# EasyEDA Pro project ProPrj_Retro-boy-color_2026-08-08.epro, schematic Schematic_V2
Create Date: 2024-07-19; Page Name: P1; Project Name: Retro-boy-color; Schematic Name: Schematic_V2; Update Date: 2026-08-08; Company: 嘉立创EDA; Page Size: A4; Version: V1.0
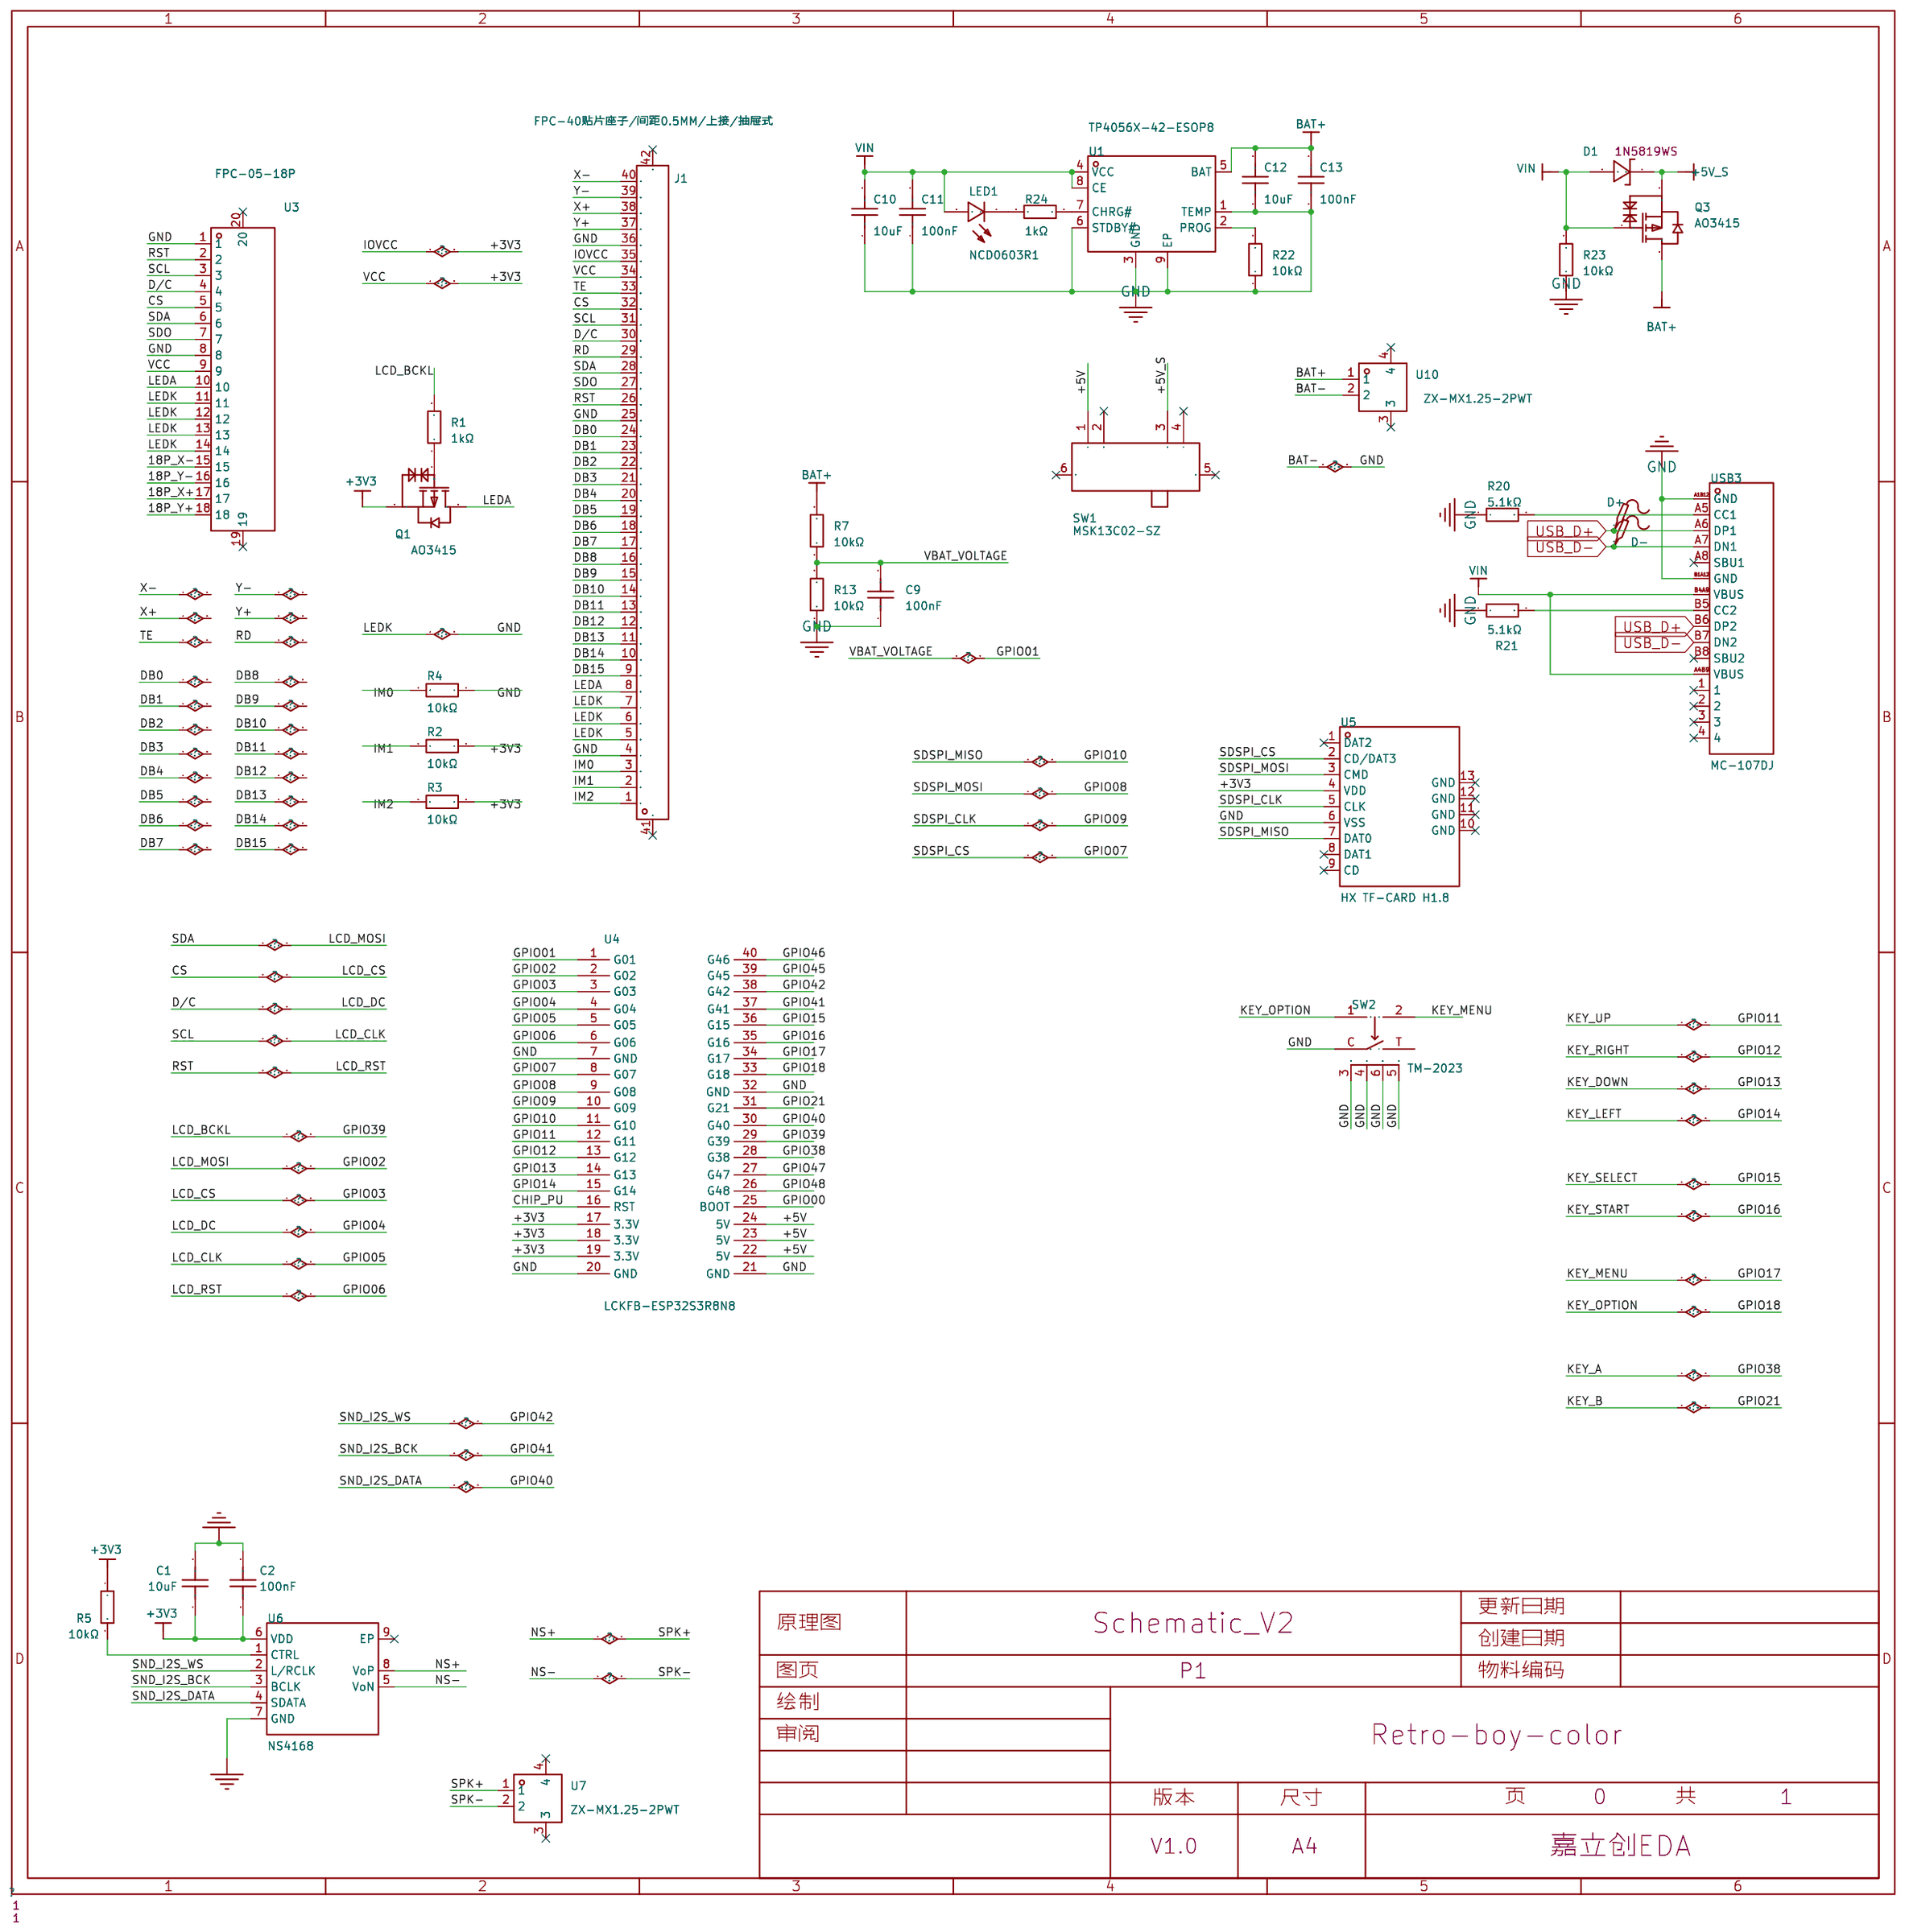
[diagram p0: schematic sheet]

## Parts
C1  10uF  [C0603]
C2  100nF  [C0603]
C9  100nF  [C0603]
C10  10uF  [C0603]
C11  100nF  [C0603]
C12  10uF  [C0603]
C13  100nF  [C0603]
D1  1N5819WS  [SOD-323_L1.8-W1.3-LS2.5-RD]
D+  -  [Test-Point-0.5mm]
D-  -  [Test-Point-0.5mm]
J1  FPC-40贴片座子/间距0.5MM/上接/抽屉式  [FPC-SMD_40P-P0.50_FPC-40-2]
LED1  NCD0603R1  [LED0603-RD_RED]
Q1  AO3415  [SOT-23-3_L2.9-W1.4-P1.90-LS2.5-BR]
Q3  AO3415  [SOT-23-3_L2.9-W1.4-P1.90-LS2.5-BR]
R1  1kΩ  [R0603]
R2  10kΩ  [R0603]
R3  10kΩ  [R0603]
R4  10kΩ  [R0603]
R5  10kΩ  [R0603]
R7  10kΩ  [R0603]
R13  10kΩ  [R0603]
R20  5.1kΩ  [R0603]
R21  5.1kΩ  [R0603]
R22  10kΩ  [R0603]
R23  10kΩ  [R0603]
R24  1kΩ  [R0603]
SW1  MSK13C02-SZ  [SW-SMD_MSK13C02-SZ]
SW2  TM-2023  [SW-SMD_TM-2023-1]
U1  TP4056X-42-ESOP8  [SOP-8_L4.9-W3.9-P1.27-LS6.0-TL-EP]
U3  FPC-05-18P  [FPC-SMD_18P-P0.50_XW05200-18]
U4  LCKFB-ESP32S3R8N8  [DIP-40_L20.32-W51.66-P2.54-LS15.24]
U5  HX TF-CARD H1.8  [TF-SMD_HX-TF-CARD-H1.8]
U6  NS4168  [ESOP-8_L4.9-W3.9-P1.27-LS6.0-BL-EP-1]
U7  ZX-MX1.25-2PWT  [CONN-SMD_2P-P1.25_MEGASTAR_ZX-MX1.25-2PWT]
U10  ZX-MX1.25-2PWT  [CONN-SMD_2P-P1.25_MEGASTAR_ZX-MX1.25-2PWT]
USB3  MC-107DJ  [TYPE-C-SMD_MC-107DJ]

## Library data of the parts
C1 C10 C12 = CL10A106MA8NRNC: 容值:10uF;精度:±20%;额定电压:25V;材质(温度系数):X5R;; LCSC Part Name: 10uF ±20% 25V; Supplier Part: C96446; Manufacturer: SAMSUNG(三星); Supplier Footprint: 0603; JLCPCB Part Class: 基础库; Datasheet: https://atta.szlcsc.com/upload/public/pdf/source/20160218/1457707763339.pdf; Supplier: LCSC; Tolerance: ±20%; Voltage Rated: 25V; Temperature Coefficient: X5R
C2 C9 C11 C13 = CC0603KRX7R9BB104: 容值:100nF;精度:±10%;额定电压:50V;材质(温度系数):X7R;; LCSC Part Name: 100nF ±10% 50V; Supplier Part: C14663; Manufacturer: YAGEO(国巨); Supplier Footprint: 0603; Datasheet: https://atta.szlcsc.com/upload/public/pdf/source/20180910/C282072_33301C7F631E79921B82A8DAC6BCC5B3.pdf; Supplier: LCSC; Tolerance: ±10%; Voltage Rated: 50V; Temperature Coefficient: X7R
D1 = 1N5819WS_C191023: 直流反向耐压(Vr):40V;平均整流电流(Io):1A;正向压降(Vf):600mV@1A;; LCSC Part Name: 40V1A600mV@1A; Supplier Part: C191023; Manufacturer: Hottech(合科泰); Supplier Footprint: SOD-323; JLCPCB Part Class: BasicPart; Datasheet: https://atta.szlcsc.com/upload/public/pdf/source/20220428/3CB86FD8D28D653594B4E35F9D5AEFD9.pdf; Supplier: LCSC; Reverse Voltage (Vr): 40V; Average Rectified Current (Io): 1A; Forward Voltage (Vf@If): 600mV@1A
D+ D- = Test-Point: Test Point 测试点
J1 = FPC-40贴片座子/间距0.5MM/上接/抽屉式: Supplier Part: C9900017908; Supplier Footprint: FPC-SMD-40P; JLCPCB Part Class: 扩展库; Supplier: LCSC
LED1 = NCD0603R1_C84263: 发光颜色:红灯;; LCSC Part Name: 红灯; Supplier Part: C84263; Manufacturer: 国星光电; Supplier Footprint: 0603; JLCPCB Part Class: 扩展库; Datasheet: https://atta.szlcsc.com/upload/public/pdf/source/20200820/C84263_DABC6A75E58F576973B407FDBA283D60.pdf; Supplier: LCSC; Emitted Color: 红灯
Q1 Q3 = AO3415: Supplier Part: C9900017638; Supplier Footprint: SOT-23; JLCPCB Part Class: 扩展库; Supplier: LCSC
R1 = 0603WAF1001T5E: 电阻类型:厚膜电阻;阻值:1kΩ;精度:±1%;功率:100mW;最大工作电压:75V;温度系数:±100ppm/℃;; LCSC Part Name: 1kΩ ±1% 100mW 厚膜电阻; Supplier Part: C21190; Manufacturer: UNI-ROYAL(厚声); Supplier Footprint: 0603; JLCPCB Part Class: 基础库; Datasheet: https://atta.szlcsc.com/upload/public/pdf/source/20200306/C422600_1E6D84923E4A46A82E41ADD87F860B5C.pdf; Supplier: LCSC; Type: 厚膜电阻; Tolerance: ±1%; Power(Watts): 100mW; Overload Voltage (Max): 75V; Temperature Coefficient: ±100ppm/℃; Operating Temperature Range: -55℃~+155℃
R2-R5 = 0603WAF1002T5E: 电阻类型:厚膜电阻;阻值:10kΩ;精度:±1%;功率:100mW;最大工作电压:75V;温度系数:±100ppm/℃;; LCSC Part Name: 厚膜电阻 10kΩ ±1% 100mW; Supplier Part: C25804; Manufacturer: UNI-ROYAL(厚声); Supplier Footprint: 0603; JLCPCB Part Class: 基础库; Datasheet: https://atta.szlcsc.com/upload/public/pdf/source/20200306/C422600_1E6D84923E4A46A82E41ADD87F860B5C.pdf; Supplier: LCSC; Type: 厚膜电阻; Tolerance: ±1%; Power(Watts): 100mW; Overload Voltage (Max): 75V; Temperature Coefficient: ±100ppm/℃; Operating Temperature Range: -55℃~+155℃
R7 R13 R22 R23 = 0603WAF1002T5E: 电阻类型:厚膜电阻;阻值:10kΩ;精度:±1%;功率:100mW;; LCSC Part Name: 厚膜电阻 10kΩ ±1% 100mW; Supplier Part: C25804; Manufacturer: UNI-ROYAL(厚声); Supplier Footprint: 0603; JLCPCB Part Class: 基础库; Datasheet: https://atta.szlcsc.com/upload/public/pdf/source/20200306/C422600_1E6D84923E4A46A82E41ADD87F860B5C.pdf; Supplier: LCSC; Type: 厚膜电阻; Tolerance: ±1%; Power(Watts): 100mW; Overload Voltage (Max): 75V; Temperature Coefficient: ±100ppm/℃; Operating Temperature Range: -55℃~+155℃
R20 R21 = 0603WAF5101T5E: 电阻类型:厚膜电阻;阻值:5.1kΩ;精度:±1%;功率:100mW;最大工作电压:75V;温度系数:±100ppm/℃;; LCSC Part Name: 5.1kΩ ±1% 100mW 厚膜电阻; Supplier Part: C23186; Manufacturer: UNI-ROYAL(厚声); Supplier Footprint: 0603; Datasheet: https://atta.szlcsc.com/upload/public/pdf/source/20200306/C422600_1E6D84923E4A46A82E41ADD87F860B5C.pdf; Supplier: LCSC; Type: 厚膜电阻; Tolerance: ±1%; Power(Watts): 100mW; Overload Voltage (Max): 75V; Temperature Coefficient: ±100ppm/℃; Operating Temperature Range: -55℃~+155℃
R24 = 0603WAF1001T5E: 电阻类型:厚膜电阻;阻值:1kΩ;精度:±1%;功率:100mW;; LCSC Part Name: 1kΩ ±1% 100mW 厚膜电阻; Supplier Part: C21190; Manufacturer: UNI-ROYAL(厚声); Supplier Footprint: 0603; JLCPCB Part Class: 基础库; Datasheet: https://atta.szlcsc.com/upload/public/pdf/source/20200306/C422600_1E6D84923E4A46A82E41ADD87F860B5C.pdf; Supplier: LCSC; Type: 厚膜电阻; Tolerance: ±1%; Power(Watts): 100mW; Overload Voltage (Max): 75V; Temperature Coefficient: ±100ppm/℃; Operating Temperature Range: -55℃~+155℃
SW1 = MSK13C02-SZ: 电路结构:单刀三掷;安装方式:卧贴;开关颜色:-;额定电流(DC):100mA;额定电压(DC):12V;额定电流(AC):-;额定电压(AC):-;机械寿命:1万次;; LCSC Part Name: 贴片拨动/三档侧拨 8脚拨动 黑柄，柄长1.5mm,耐温袋装，高品质; Supplier Part: C2681569; Manufacturer: SHOU HAN(首韩); Supplier Footprint: SMD; JLCPCB Part Class: 扩展库; Datasheet: https://atta.szlcsc.com/upload/public/pdf/source/20231031/C8BED455619FEEF308EBA39F2FB3EDEE.pdf; Supplier: LCSC; Circuit: 单刀三掷; Pin Style: SMD接片; Switch Length: 9.9mm; Switch Width: 2.7mm; Switch Height: 1.5mm; Mounting Style: 卧贴; Current Rating (DC): 100mA; Voltage Rating (DC): 12V; Mechanical Life: 1万次; Operating Temperature: -25℃~+70℃
SW2 = TM-2023: 3挡拨轮开关  音响周边开关 多功能开关上中下按键; LCSC Part Name: 3挡拨轮开关; Supplier Part: C318951; Manufacturer: XKB Connectivity(中国星坤); Supplier Footprint: SMD-8P,9.5x9.5mm; JLCPCB Part Class: 扩展库; Datasheet: https://atta.szlcsc.com/upload/public/pdf/source/20211015/4E21B3A9DEF1E687333BA1DF36F89D09.pdf; Supplier: LCSC
U1 = TP4056X-42-ESOP8: Supplier Part: C2763448; Manufacturer: TOPPOWER(南京拓微); Supplier Footprint: SOP-8-EP-150mil; JLCPCB Part Class: 扩展库; Datasheet: https://atta.szlcsc.com/upload/public/pdf/source/20221111/3D7D53D5011BF4ED4C4D0D9BFDBB1404.pdf; Supplier: LCSC
U3 = FPC-05-18P: Supplier Part: C9900014287; JLCPCB Part Class: 扩展库; Supplier: LCSC
U4 = LCKFB-ESP32S3R8N8: LCSC Part Name: 立创·ESP32S3R8N8 开发板; Supplier Part: C20626143; Manufacturer: 立创开发板; Datasheet: https://atta.szlcsc.com/upload/public/pdf/source/20240305/5BD17ECD91284FC4EAAB3B5676669C6C.pdf; Supplier: LCSC
U5 = HX TF-CARD H1.8: 卡连接方式:自弹式;卡类型:MicroSD卡(TF卡);连接器类型:卡座;本体最大高度:1.8mm;触头材质:铜合金;触头镀层:金;工作温度范围:-40℃~+70℃;; LCSC Part Name: 自弹式 MicroSD卡(TF卡) 卡座; Supplier Part: C19189036; Manufacturer: hanxia(韩下); Supplier Footprint: SMD; Datasheet: https://atta.szlcsc.com/upload/public/pdf/source/20231103/42D1E7AC2772CC1CF5ED366AE800D376.pdf; Supplier: LCSC; Card Connection Mode: 自弹式; Card Type: MicroSD卡(TF卡); Connector Type: 卡座; Maximum Body Height: 1.8mm; Contact Material: 铜合金; Contact Plating: 金; Operating Temperature Range: -40℃~+70℃
U6 = NS4168: Supplier Part: C9900042517; Supplier Footprint: ESOP-8; Supplier: LCSC
U7 U10 = ZX-MX1.25-2PWT: 插针结构:1x2P;间距:1.25mm;安装方式:卧贴;参考系列:-;总PIN数:2P;排数:1;每排PIN数:2;行距:-;额定电流:1A;触头材质:黄铜;触头镀层:锡;工作温度范围:-25℃~+85℃;; LCSC Part Name: 1x2P 间距:1.25mm 卧贴; Supplier Part: C7430468; Manufacturer: Megastar(兆星); Supplier Footprint: SMD,P=1.25mm,卧贴; JLCPCB Part Class: 扩展库; Datasheet: https://atta.szlcsc.com/upload/public/pdf/source/20230619/2BD294665F872DB10EDB44FDEDF5F6D3.pdf; Supplier: LCSC; Pins Structure: 1x2P; Pitch: 1.25mm; Mounting Style: 卧贴; Number of Pins: 2P; Number of Rows: 1; Number of PINs Per Row: 2; Current Rating (Max): 1A; Contact Material: 黄铜; Contact Plating: 锡; Operating Temperature Range: -25℃~+85℃
USB3 = MC-107DJ: 连接器类型:Type-C;标准:USB 3.1;公母:母;端口数量:1;触点数量:16P;安装方式:卧贴;额定电流 - 电源:5A;触头材质:-;触头镀层:-;工作温度范围:-30℃~+85℃;焊接温度(最大值):-;; LCSC Part Name: Type-C 母 卧贴; Supplier Part: C3039323; Manufacturer: HANBO(汉博); Supplier Footprint: SMD; JLCPCB Part Class: 扩展库; Datasheet: https://atta.szlcsc.com/upload/public/pdf/source/20221111/FC1EB886C14056FAD47B50E8694458AD.pdf; Supplier: LCSC; Connector Type: Type-C; Standard: USB 3.1; Gender: 母; Number of Ports: 1; Number of Contacts: 16P; Mounting Style: 卧贴; Current Rating - Power (Max): 5A; Operating Temperature Range: -30℃~+85℃

## Nets
+3V3: C1.1 C2.1 J1.34 J1.35 Q1.2(S) R2.1 R3.1 R5.1 U3.9 U4.17(3.3V) U4.18(3.3V) U4.19(3.3V) U5.4(VDD) U6.6(VDD)
+5V: SW1.1 U4.22(5V) U4.23(5V) U4.24(5V)
+5V_S: D1.1(C) Q3.2(S) SW1.3
GND: C1.2 C2.2 C9.1 C10.1 C11.1 C12.1 C13.1 J1.4 J1.5 J1.6 J1.7 J1.25 J1.36 R4.1 R13.1 R20.1 R21.1 R22.1 R23.1 SW2.3 SW2.4 SW2.5 SW2.6 SW2.C U1.1(TEMP) U1.3(GND) U1.6(STDBY#) U1.9(EP) U3.1 U3.8 U3.11 U3.12 U3.13 U3.14 U4.7(GND) U4.20(GND) U4.21(GND) U4.32(GND) U5.6(VSS) U6.7(GND) U10.2 USB3.A1B12(GND) USB3.B1A12(GND)
VIN: C10.2 C11.2 D1.2(A) LED1.2(A) Q3.1(G) R23.2 U1.4(VCC) U1.8(CE) USB3.A4B9(VBUS) USB3.B4A9(VBUS)
18P_X+: U3.17
18P_X-: U3.15
18P_Y+: U3.18
18P_Y-: U3.16
BAT+: C12.2 C13.2 Q3.3(D) R7.2 U1.5(BAT) U10.1
CHIP_PU: U4.16(RST)
CS: J1.32 U3.5 U4.3(G03)
D/C: J1.30 U3.4 U4.4(G04)
DB0: J1.24
DB1: J1.23
DB2: J1.22
DB3: J1.21
DB4: J1.20
DB5: J1.19
DB6: J1.18
DB7: J1.17
DB8: J1.16
DB9: J1.15
DB10: J1.14
DB11: J1.13
DB12: J1.12
DB13: J1.11
DB14: J1.10
DB15: J1.9
GPIO00: U4.25(BOOT)
GPIO01: C9.2 R7.1 R13.2 U4.1(G01)
GPIO02: J1.28 U3.6 U4.2(G02)
GPIO05: J1.31 U3.3 U4.5(G05)
GPIO06: J1.26 U3.2 U4.6(G06)
GPIO07: U4.8(G07) U5.2(CD/DAT3)
GPIO08: U4.9(G08) U5.3(CMD)
GPIO09: U4.10(G09) U5.5(CLK)
GPIO10: U4.11(G10) U5.7(DAT0)
GPIO11: U4.12(G11)
GPIO12: U4.13(G12)
GPIO13: U4.14(G13)
GPIO14: U4.15(G14)
GPIO15: U4.36(G15)
GPIO16: U4.35(G16)
GPIO17: SW2.2 U4.34(G17)
GPIO18: SW2.1 U4.33(G18)
GPIO21: U4.31(G21)
GPIO38: U4.28(G38)
GPIO39: R1.2 U4.29(G39)
GPIO40: U4.30(G40) U6.4(SDATA)
GPIO41: U4.37(G41) U6.3(BCLK)
GPIO42: U4.38(G42) U6.2(L/RCLK)
GPIO45: U4.39(G45)
GPIO46: U4.40(G46)
GPIO47: U4.27(G47)
GPIO48: U4.26(G48)
IM0: J1.3 R4.2
IM1: J1.2 R2.2
IM2: J1.1 R3.2
LEDA: J1.8 Q1.3(D) U3.10
NS+: U6.8(VoP) U7.1
NS-: U6.5(VoN) U7.2
RD: J1.29
SDO: J1.27 U3.7
TE: J1.33
USB_D+: D+.1 USB3.A6(DP1) USB3.B6(DP2)
USB_D-: D-.1 USB3.A7(DN1) USB3.B7(DN2)
X+: J1.38
X-: J1.40
Y+: J1.37
Y-: J1.39
$1N1508: Q1.1(G) R1.1
$1N4956: R5.2 U6.1(CTRL)
$1N7118: R21.2 USB3.B5(CC2)
$1N7119: R20.2 USB3.A5(CC1)
$1N8079: R22.2 U1.2(PROG)
$1N8081: R24.2 U1.7(CHRG#)
$1N8083: LED1.1(K) R24.1

Not connected (* = marked no-connect by the designer): J1 41* 42*; SW1 2* 4* 5* 6*; SW2 T; U3 19* 20*; U5 1(DAT2)* 8(DAT1)* 9(CD)* 10(GND)* 11(GND)* 12(GND)* 13(GND)*; U6 9(EP)*; U7 3* 4*; U10 3* 4*; USB3 1* 2* 3* 4* A8(SBU1)* B8(SBU2)*
